# Altium schematic sheet B36-V1.2.SchDoc
size A2
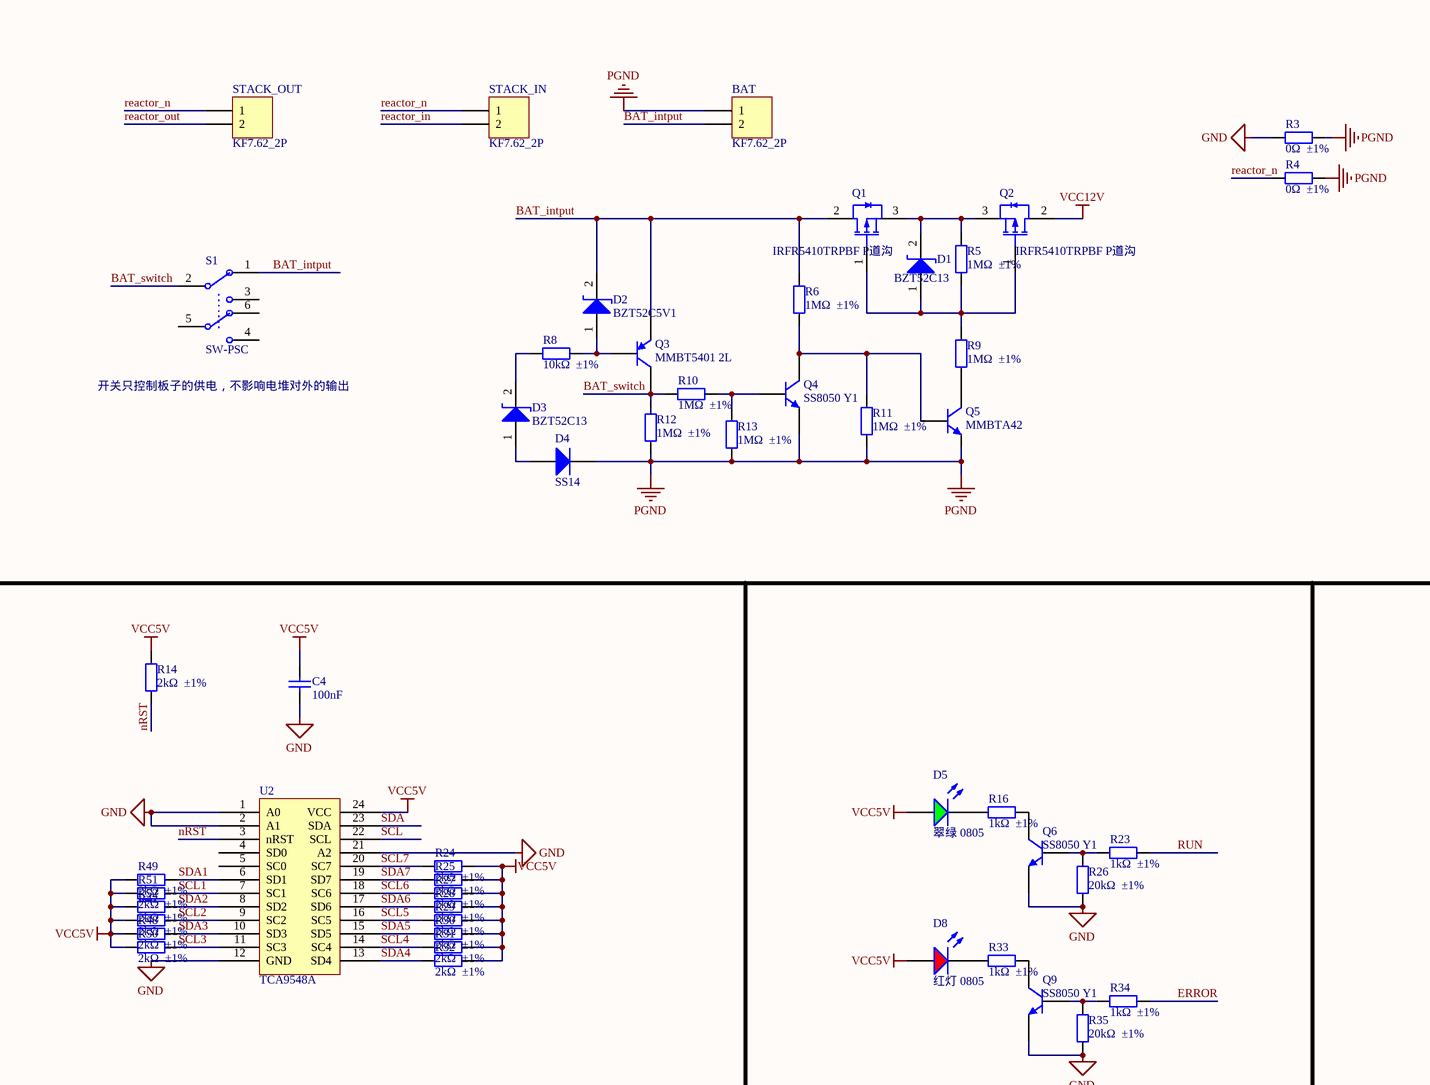
[diagram p0: B36-V1.2.SchDoc, top left]
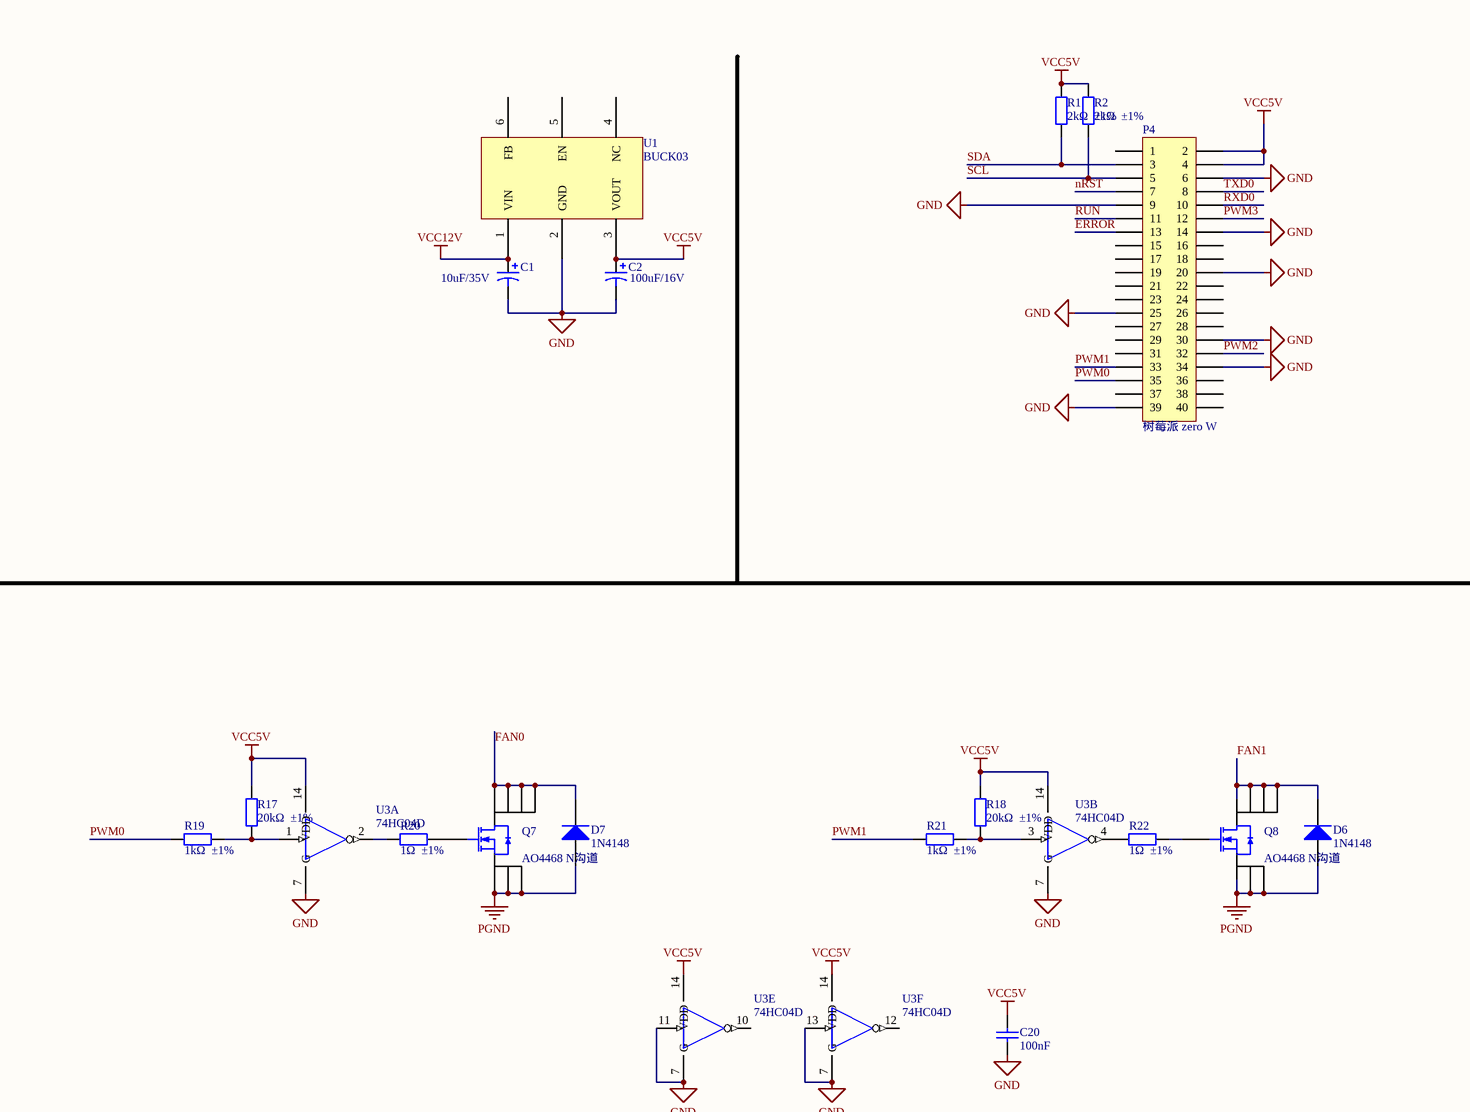
[diagram p1: B36-V1.2.SchDoc, top right]
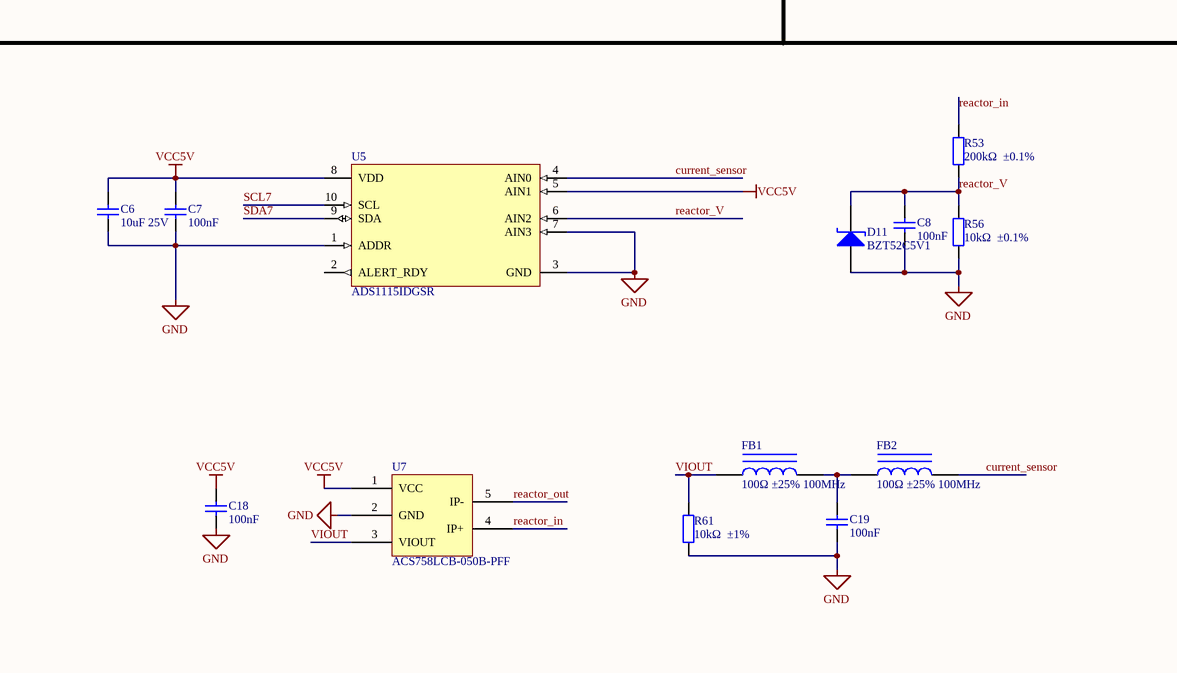
[diagram p2: B36-V1.2.SchDoc, bottom left]
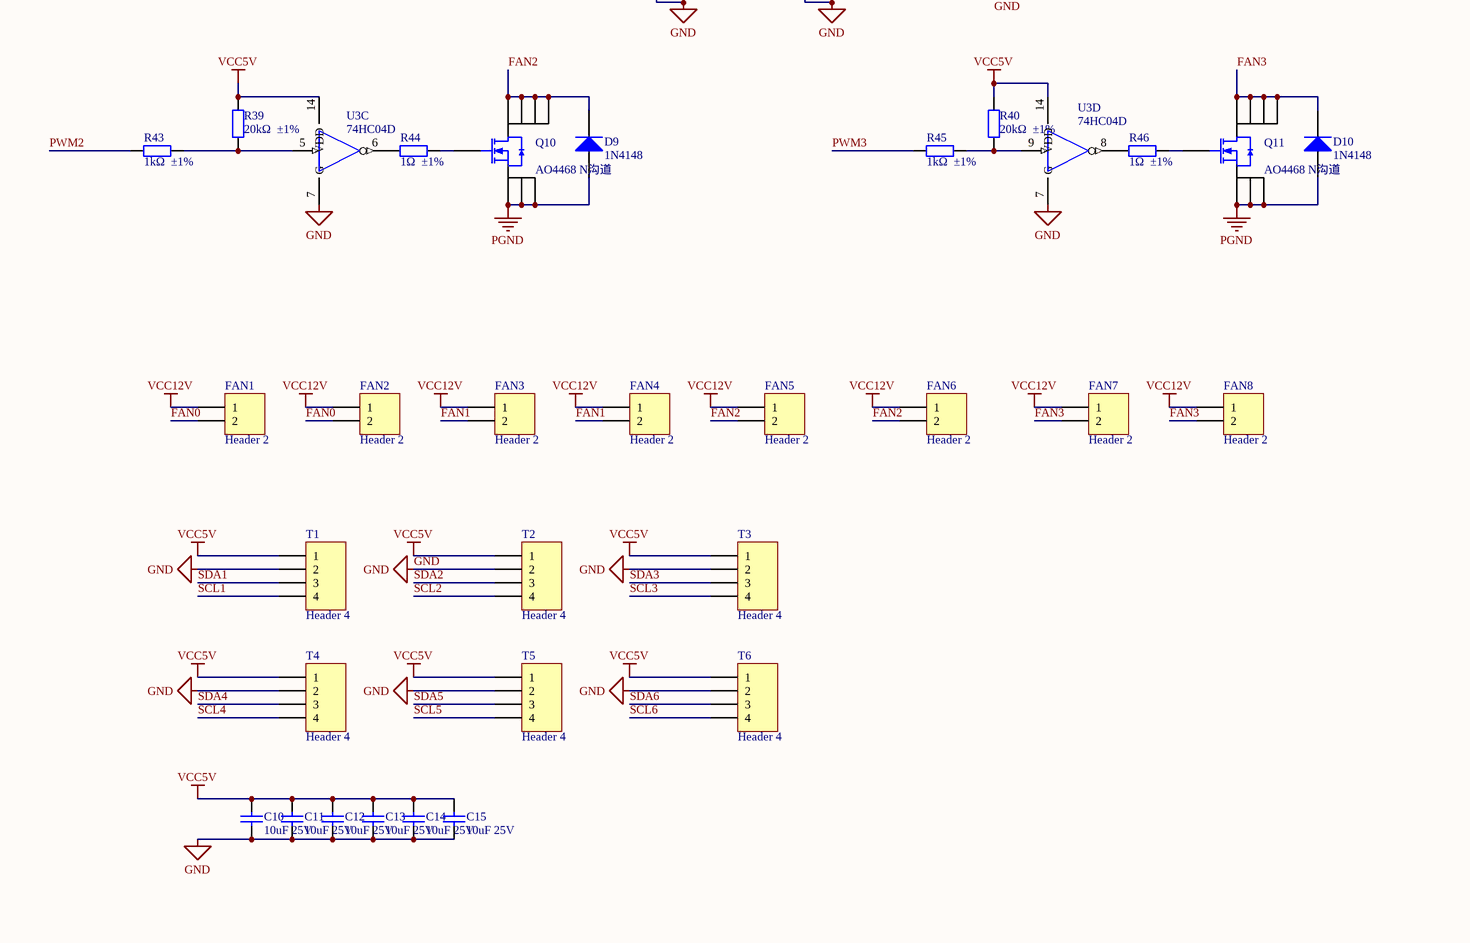
[diagram p3: B36-V1.2.SchDoc, bottom right]

## Parts
BAT  KF7.62_2P  [KF7.62_2P]
C1  10uF/35V  [CASE-C_6032]
C2  100uF/16V  [CASE-C_6032]
C4  100nF  [0603_C]
C6  10uF 25V  [0603_C]
C7  100nF  [0603_C]
C8  100nF  [0603_C]
C10  10uF 25V  [0805_C]
C11  10uF 25V  [0805_C]
C12  10uF 25V  [0805_C]
C13  10uF 25V  [0805_C]
C14  10uF 25V  [0805_C]
C15  10uF 25V  [0805_C]
C18  100nF  [0603_C]
C19  100nF  [0603_C]
C20  100nF  [0603_C]
D1  BZT52C13  [sod-123]
D2  BZT52C5V1  [sod-123]
D3  BZT52C13  [sod-123]
D4  SS14  [sod-123]
D5  翠绿 0805  [0805_LED_S1]
D6  1N4148  [SOD-123]
D7  1N4148  [SOD-123]
D8  红灯 0805  [0805_LED_S1]
D9  1N4148  [SOD-123]
D10  1N4148  [SOD-123]
D11  BZT52C5V1  [sod-123]
FAN1  Header 2  [xh2.54_2p]
FAN2  Header 2  [xh2.54_2p]
FAN3  Header 2  [xh2.54_2p]
FAN4  Header 2  [xh2.54_2p]
FAN5  Header 2  [xh2.54_2p]
FAN6  Header 2  [xh2.54_2p]
FAN7  Header 2  [xh2.54_2p]
FAN8  Header 2  [xh2.54_2p]
FB1  100Ω ±25% 100MHz  [0805_L]
FB2  100Ω ±25% 100MHz  [0805_L]
P4  树莓派 zero W  [ZERO_W]
Q1  IRFR5410TRPBF P道沟  [to-252-2]
Q2  IRFR5410TRPBF P道沟  [to-252-2]
Q3  MMBT5401 2L  [SOT-23-3L]
Q4  SS8050 Y1  [SOT-23(SOT-23-3)]
Q5  MMBTA42  [SOT-23(SOT-23-3)]
Q6  SS8050 Y1  [SOT-23(SOT-23-3)]
Q7  AO4468 N沟道  [SOIC-8_150mil]
Q8  AO4468 N沟道  [SOIC-8_150mil]
Q9  SS8050 Y1  [SOT-23(SOT-23-3)]
Q10  AO4468 N沟道  [SOIC-8_150mil]
Q11  AO4468 N沟道  [SOIC-8_150mil]
R1  2kΩ  ±1%  [0603_R]
R2  2kΩ  ±1%  [0603_R]
R3  0Ω  ±1%  [0603_R]
R4  0Ω  ±1%  [0603_R]
R5  1MΩ  ±1%  [0603_R]
R6  1MΩ  ±1%  [0603_R]
R8  10kΩ  ±1%  [0603_R]
R9  1MΩ  ±1%  [0603_R]
R10  1MΩ  ±1%  [0603_R]
R11  1MΩ  ±1%  [0603_R]
R12  1MΩ  ±1%  [0603_R]
R13  1MΩ  ±1%  [0603_R]
R14  2kΩ  ±1%  [0603_R]
R16  1kΩ  ±1%  [0603_R]
R17  20kΩ  ±1%  [0603_R]
R18  20kΩ  ±1%  [0603_R]
R19  1kΩ  ±1%  [0603_R]
R20  1Ω  ±1%  [0603_R]
R21  1kΩ  ±1%  [0603_R]
R22  1Ω  ±1%  [0603_R]
R23  1kΩ  ±1%  [0603_R]
R24  2kΩ  ±1%  [0603_R]
R25  2kΩ  ±1%  [0603_R]
R26  20kΩ  ±1%  [0603_R]
R27  2kΩ  ±1%  [0603_R]
R28  2kΩ  ±1%  [0603_R]
R29  2kΩ  ±1%  [0603_R]
R30  2kΩ  ±1%  [0603_R]
R31  2kΩ  ±1%  [0603_R]
R32  2kΩ  ±1%  [0603_R]
R33  1kΩ  ±1%  [0603_R]
R34  1kΩ  ±1%  [0603_R]
R35  20kΩ  ±1%  [0603_R]
R39  20kΩ  ±1%  [0603_R]
R40  20kΩ  ±1%  [0603_R]
R42  2kΩ  ±1%  [0603_R]
R43  1kΩ  ±1%  [0603_R]
R44  1Ω  ±1%  [0603_R]
R45  1kΩ  ±1%  [0603_R]
R46  1Ω  ±1%  [0603_R]
R48  2kΩ  ±1%  [0603_R]
R49  2kΩ  ±1%  [0603_R]
R50  2kΩ  ±1%  [0603_R]
R51  2kΩ  ±1%  [0603_R]
R52  2kΩ  ±1%  [0603_R]
R53  200kΩ  ±0.1%  [0603_R]
R56  10kΩ  ±0.1%  [0603_R]
R61  10kΩ  ±1%  [0603_R]
S1  SW-PSC  [SW_PSC]
STACK_IN  KF7.62_2P  [KF7.62_2P]
STACK_OUT  KF7.62_2P  [KF7.62_2P]
T1  Header 4  [xh1.25_4p]
T2  Header 4  [xh1.25_4p]
T3  Header 4  [xh1.25_4p]
T4  Header 4  [xh1.25_4p]
T5  Header 4  [xh1.25_4p]
T6  Header 4  [xh1.25_4p]
U1  BUCK03  [BUCK03-2]
U2  TCA9548A  [TSSOP-24]
U3  74HC04D  [SOIC-14_150mil]  (parts A,B,C,D,E,F of 6)
U5  ADS1115IDGSR  [MSOP-10]
U7  ACS758LCB-050B-PFF  [PFF]

## Nets
GND: C1.2 C2.2 C4.1 C6.1 C7.1 C8.1 C10.1 C11.1 C12.1 C13.1 C14.1 C15.1 C18.1 C19.1 C20.1 D11.1(A) P4.6 P4.9 P4.14 P4.20 P4.25 P4.30 P4.34 P4.39 Q6.2(E) Q9.2(E) R3.1 R26.2 R35.2 R56.2 R61.2 T1.2 T2.2 T3.2 T4.2 T5.2 T6.2 U1.2(GND) U2.1(A0) U2.2(A1) U2.12(GND) U2.21(A2) U3.7(G) U3.11(A) U3.13(A) U5.1(ADDR) U5.3(GND) U5.7(AIN3) U7.2(GND)
PGND: BAT.1 D4.2(K) D6.1(A) D7.1(A) D9.1(A) D10.1(A) Q4.2(E) Q5.2(E) Q7.1(S) Q7.2(S) Q7.3(S) Q8.1(S) Q8.2(S) Q8.3(S) Q10.1(S) Q10.2(S) Q10.3(S) Q11.1(S) Q11.2(S) Q11.3(S) R3.2 R4.2 R11.1 R12.2 R13.1
VCC5V: C2.1 C4.2 C6.2 C7.2 C10.2 C11.2 C12.2 C13.2 C14.2 C15.2 C18.2 C20.2 D5.A D8.A P4.2 P4.4 R1.1 R2.1 R14.1 R17.1 R18.1 R24.2 R25.2 R27.2 R28.2 R29.2 R30.2 R31.2 R32.2 R39.1 R40.1 R42.1 R48.2 R49.1 R50.2 R51.1 R52.1 T1.1 T2.1 T3.1 T4.1 T5.1 T6.1 U1.3(VOUT) U2.24(VCC) U3.14(VDD) U5.5(AIN1) U5.8(VDD) U7.1(VCC)
VCC12V: C1.1 FAN1.1 FAN2.1 FAN3.1 FAN4.1 FAN5.1 FAN6.1 FAN7.1 FAN8.1 Q2.2(D) U1.1(VIN)
BAT_intput: BAT.2 D2.2(K) Q1.2(D) Q3.2(E) R6.2 S1.1
BAT_switch: Q3.3(C) R10.2 R12.1 S1.2
current_sensor: FB2.2 U5.4(AIN0)
ERROR: P4.13 R34.1
FAN0: D7.2(K) FAN1.2 FAN2.2 Q7.5(D) Q7.6(D) Q7.7(D) Q7.8(D)
FAN1: D6.2(K) FAN3.2 FAN4.2 Q8.5(D) Q8.6(D) Q8.7(D) Q8.8(D)
FAN2: D9.2(K) FAN5.2 FAN6.2 Q10.5(D) Q10.6(D) Q10.7(D) Q10.8(D)
FAN3: D10.2(K) FAN7.2 FAN8.2 Q11.5(D) Q11.6(D) Q11.7(D) Q11.8(D)
nRST: P4.7 R14.2 U2.3(nRST)
PWM0: P4.35 R19.2
PWM1: P4.33 R21.2
PWM2: P4.32 R43.2
PWM3: P4.12 R45.2
reactor_in: R53.1 STACK_IN.2 U7.4(IP+)
reactor_n: R4.1 STACK_IN.1 STACK_OUT.1
reactor_out: STACK_OUT.2 U7.5(IP-)
reactor_V: C8.2 D11.2(K) R53.2 R56.1 U5.6(AIN2)
RUN: P4.11 R23.1
RXD0: P4.10
SCL: P4.5 R2.2 U2.22(SCL)
SCL1: R51.2 T1.4 U2.7(SC1)
SCL2: R42.2 T2.4 U2.9(SC2)
SCL3: R50.1 T3.4 U2.11(SC3)
SCL4: R31.1 T4.4 U2.14(SC4)
SCL5: R29.1 T5.4 U2.16(SC5)
SCL6: R27.1 T6.4 U2.18(SC6)
SCL7: R24.1 U2.20(SC7) U5.10(SCL)
SDA: P4.3 R1.2 U2.23(SDA)
SDA1: R49.2 T1.3 U2.6(SD1)
SDA2: R52.2 T2.3 U2.8(SD2)
SDA3: R48.1 T3.3 U2.10(SD3)
SDA4: R32.1 T4.3 U2.13(SD4)
SDA5: R30.1 T5.3 U2.15(SD5)
SDA6: R28.1 T6.3 U2.17(SD6)
SDA7: R25.1 U2.19(SD7) U5.9(SDA)
TXD0: P4.8
VIOUT: FB1.1 R61.1 U7.3(VIOUT)
NetC19_2: C19.2 FB1.2 FB2.1
NetD1_1: D1.1(A) Q1.1(G) Q2.1(G) R5.1 R9.2
NetD1_2: D1.2(K) Q1.3(S) Q2.3(S) R5.2
NetD2_1: D2.1(A) Q3.1(B) R8.1
NetD3_1: D3.1(A) D4.1(A)
NetD3_2: D3.2(K) R8.2
NetD5_K: D5.K R16.2
NetD8_K: D8.K R33.2
NetQ4_1: Q4.1(B) R10.1 R13.2
NetQ4_3: Q4.3(C) Q5.1(B) R6.1 R11.2
NetQ5_3: Q5.3(C) R9.1
NetQ6_1: Q6.1(B) R23.2 R26.1
NetQ6_3: Q6.3(C) R16.1
NetQ7_4: Q7.4(G) R20.2
NetQ8_4: Q8.4(G) R22.2
NetQ9_1: Q9.1(B) R34.2 R35.1
NetQ9_3: Q9.3(C) R33.1
NetQ10_4: Q10.4(G) R44.2
NetQ11_4: Q11.4(G) R46.2
NetR17_2: R17.2 R19.1 U3.1(A)
NetR18_2: R18.2 R21.1 U3.3(A)
NetR20_1: R20.1 U3.2(Y)
NetR22_1: R22.1 U3.4(Y)
NetR39_2: R39.2 R43.1 U3.5(A)
NetR40_2: R40.2 R45.1 U3.9(A)
NetR44_1: R44.1 U3.6(Y)
NetR46_1: R46.1 U3.8(Y)

Not connected (* = marked no-connect by the designer): P4 1 15 16 17 18 19 21 22 23 24 26 27 28 29 31 36 37 38 40; S1 3 4 5 6; U1 4(NC) 5(EN) 6(FB); U2 4(SD0) 5(SC0); U3 10(Y) 12(Y); U5 2(ALERT_RDY)

## Notes on the sheet
- (near S1) 开关只控制板子的供电，不影响电堆对外的输出

## Library data of the parts
BAT FAN1-FAN8 STACK_IN STACK_OUT = Header 2: Header, 2-Pin; LatestRevisionDate: 17-Jul-2002; LatestRevisionNote: Re-released for DXP Platform.; Publisher: Altium Limited
C1 C2 = Cap Pol1: Polarized Capacitor (Radial); Published: 8-Jun-2000; LatestRevisionDate: 17-Jul-2002; LatestRevisionNote: Re-released for DXP Platform.; PackageReference: RB7.6-15; Publisher: Altium Limited; PackageDescription: Polarized Capacitor (Radial); 2 Leads
  C1: Value: 10uF/35V
  C2: Value: 100uF/16V
C4 C7 C8 C18-C20 = 0603 1.0pF (010) 0.25pF 50V: 贴片电容; ComponentLink1Description: 供应商链接; ComponentLink1URL: http://www.szlcsc.com/product/details_24709.html; Package: 0603; Supplier: LC; SuppliersPartNumber: C23969
C6 C10-C15 = 0805 6.8nF (682) 10% 50V: 贴片电容; ComponentLink1Description: 供应商链接; ComponentLink1URL: http://www.szlcsc.com/product/details_2107.html; Package: 0805; Supplier: LC; SuppliersPartNumber: C1755
D1-D3 D11 = Diode-Z: 稳压二极管; Published: 8-Jun-2000; LatestRevisionDate: 17-Jul-2002; LatestRevisionNote: Re-released for DXP Platform.; PackageReference: SMB; Publisher: Altium Limited; Code_JEDEC: DO-214-AA
D4 = SMA(DO-214AC) SS54: 二极管; ComponentLink1Description: 供应商链接; ComponentLink1URL: http://www.szlcsc.com/product/details_23178.html; Package: SMA(DO-214AC); Supplier: LC; SuppliersPartNumber: C22452
D5 = 0805 翠绿: 发光二极管; ComponentLink1Description: 供应商链接; ComponentLink1URL: http://www.szlcsc.com/product/details_2670.html; Package: 0805; Supplier: LC; SuppliersPartNumber: C2297
D6 D7 D9 D10 = SOD-123 B5819W  SL: 肖特基二极管; ComponentLink1Description: 供应商链接; ComponentLink1URL: http://www.szlcsc.com/product/details_9093.html; Package: SOD-123; Supplier: LC; SuppliersPartNumber: C8598
D8 = 0805 红灯: 发光二极管; ComponentLink1Description: 供应商链接; ComponentLink1URL: http://www.szlcsc.com/product/details_2668.html; Package: 0805; Supplier: LC; SuppliersPartNumber: C2295
FB1 FB2 = 0805 100Ω 25% 100MHz: 贴片磁珠; ComponentLink1Description: 供应商链接; ComponentLink1URL: http://www.szlcsc.com/product/details_1367.html; Package: 0805; Supplier: LC; SuppliersPartNumber: C1015
P4 = Header 20X2: Header, 20-Pin, Dual row; LatestRevisionDate: 17-Jul-2002; LatestRevisionNote: Re-released for DXP Platform.; Publisher: Altium Limited
Q1 Q2 = AOD4185L P道沟: MOS(场效应管); ComponentLink1Description: 供应商链接; ComponentLink1URL: http://www.szlcsc.com/product/details_15801.html; Package: SOT-23; Supplier: LC; SuppliersPartNumber: C15127
Q3 = SOT-23 MMBT5401 2L: 三极管; ComponentLink1Description: 供应商链接; ComponentLink1URL: http://www.szlcsc.com/product/details_8818.html; Package: SOT-23; Supplier: LC; SuppliersPartNumber: C8326
Q4-Q6 Q9 = SOT-23 SS8050 Y1: 三极管; ComponentLink1Description: 供应商链接; ComponentLink1URL: http://www.szlcsc.com/product/details_2507.html; Package: SOT-23; Supplier: LC; SuppliersPartNumber: C2150
Q7 Q8 Q10 Q11 = AO4468 N沟道: MOS(场效应管); ComponentLink1Description: 供应商链接; ComponentLink1URL: http://www.szlcsc.com/product/details_16754.html; Package: SOIC-8_150mil; Supplier: LC; SuppliersPartNumber: C16072
R1-R4 R8 R14 R16-R35 R39 R40 R42-R46 R48-R53 R56 R61 = 0603 1Ω (1R00) 1%: 贴片电阻; ComponentLink1Description: 供应商链接; ComponentLink1URL: http://www.szlcsc.com/product/details_23663.html; Package: 0603; Supplier: LC; SuppliersPartNumber: C22936
R5 R6 R9-R11 R13 = 0603 1MΩ (1004) 1%: 贴片电阻; ComponentLink1Description: 供应商链接; ComponentLink1URL: http://www.szlcsc.com/product/details_23662.html; Package: 0603; Supplier: LC; SuppliersPartNumber: C22935
R12 = 0805 1MΩ (1004) 1%: 贴片电阻; ComponentLink1Description: 供应商链接; ComponentLink1URL: http://www.szlcsc.com/product/details_18202.html; Package: 0805; Supplier: LC; SuppliersPartNumber: C17514
S1 = SW-PSC: 自锁开关 两侧 6脚; Published: 24-Mar-1999; LatestRevisionDate: 17-Jul-2002; LatestRevisionNote: Re-released for DXP Platform.; PackageReference: DPDT-6; Publisher: Altium Limited
T1-T6 = Header 4: Header, 4-Pin; LatestRevisionDate: 17-Jul-2002; LatestRevisionNote: Re-released for DXP Platform.; Publisher: Altium Limited
U1 = BUCK03: 引出FB和EN的迷你型5V4A模块
U3 = 74HC04D_[C5590]: 74系列逻辑芯片; ComponentLink1Description: 供应商链接; ComponentLink1URL: http://www.szlcsc.com/product/details_6041.html; Package: SOIC-14_150mil; Supplier: LC; SuppliersPartNumber: C5590
U5 = ADS1115IDGSR: Imported; Manufacturer: Texas Instruments; PartNumber: ADS1115IDGSR; RefDes: RefDes; TYPE: TYPE; Value: Value
U7 = ACS758